# Altium schematic sheet 3_ADC.SCHDOC
size 297 x 209 mm; SheetNumber: 10; SheetTotal: 18; DocumentName: 3_ADC.SCHDOC
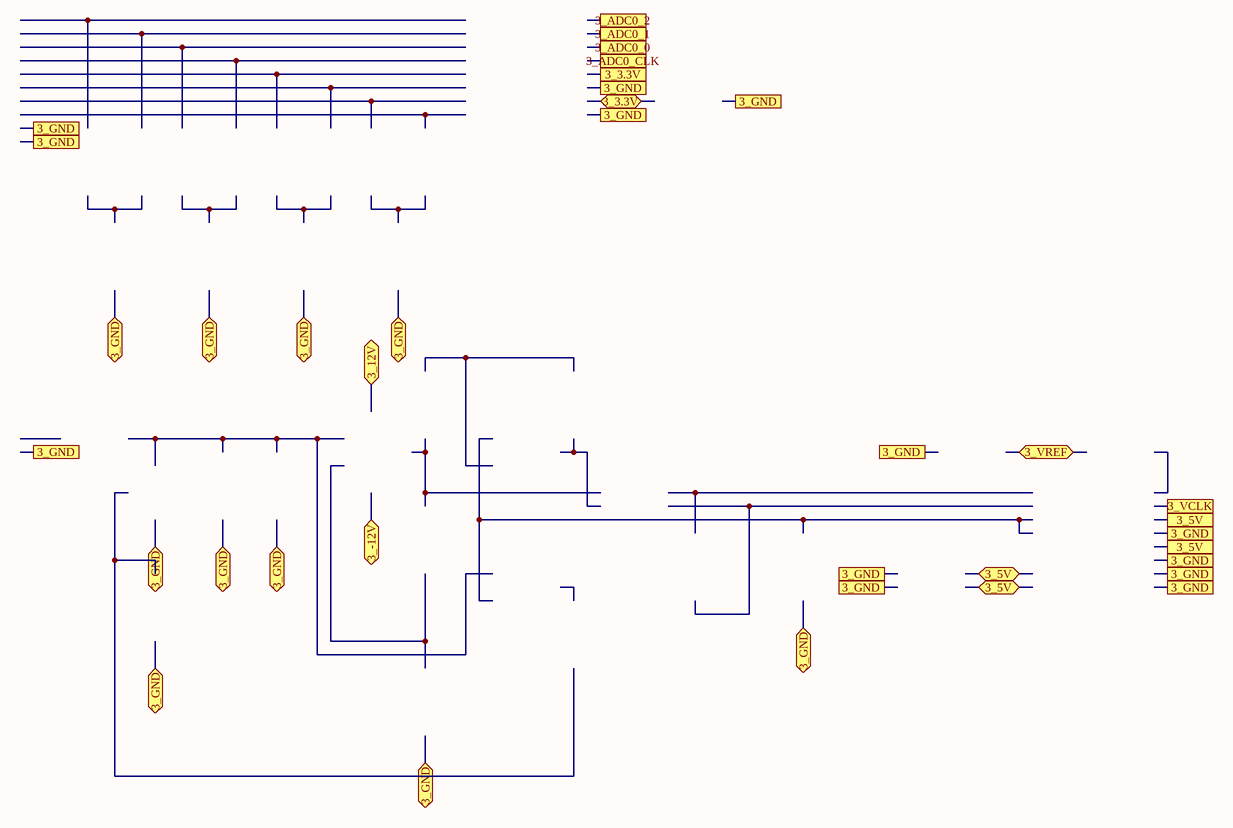
[diagram p0: 3_ADC.SCHDOC]

## Ports
3_3.3V, 3_3.3V (bidir), 3_5V, 3_5V (bidir), 3_12V, 3_-12V, 3_ADC0_0, 3_ADC0_1, 3_ADC0_2, 3_ADC0_CLK, 3_GND, 3_VCLK, 3_VREF (bidir)

## Notes on the sheet
- A
- B
- C
- D
- 1
- 2
- 3
- Title
- 4
- Size
- A4
- Number
- Rev
- Date
- Filename
- Drawn by
- Sheet
- of